# Altium schematic sheet ОУ LM741.SchDoc
size A4; SheetNumber: 1; SheetTotal: 1
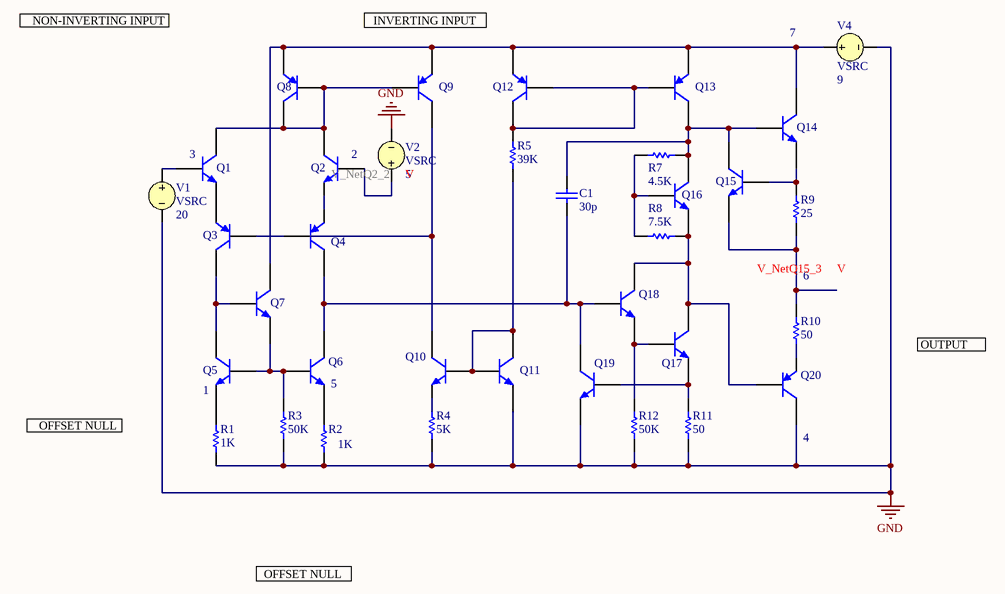
[diagram p0: ОУ LM741.SchDoc]

## Parts
C1  value 30p  (hidden comment: Capacitor)
Q1  Bipolar  NPN 3 Pins  Transistor VBIC Model  (value not drawn)
Q2  Bipolar  NPN 3 Pins  Transistor VBIC Model  (value not drawn)
Q3  Bipolar  PNP 3 Pins  Transistor  Gummel-Poon Model  (value not drawn)
Q4  Bipolar  PNP 3 Pins  Transistor  Gummel-Poon Model  (value not drawn)
Q5  Bipolar  NPN 3 Pins  Transistor VBIC Model  (value not drawn)
Q6  Bipolar  NPN 3 Pins  Transistor VBIC Model  (value not drawn)
Q7  Bipolar  NPN 3 Pins  Transistor VBIC Model  (value not drawn)
Q8  Bipolar  PNP 3 Pins  Transistor  Gummel-Poon Model  (value not drawn)
Q9  Bipolar  PNP 3 Pins  Transistor  Gummel-Poon Model  (value not drawn)
Q10  Bipolar  NPN 3 Pins  Transistor VBIC Model  (value not drawn)
Q11  Bipolar  NPN 3 Pins  Transistor VBIC Model  (value not drawn)
Q12  Bipolar  PNP 3 Pins  Transistor  Gummel-Poon Model  (value not drawn)
Q13  Bipolar  PNP 3 Pins  Transistor  Gummel-Poon Model  (value not drawn)
Q14  Bipolar  NPN 3 Pins  Transistor VBIC Model  (value not drawn)
Q15  Bipolar  NPN 3 Pins  Transistor VBIC Model  (value not drawn)
Q16  Bipolar  NPN 3 Pins  Transistor VBIC Model  (value not drawn)
Q17  Bipolar  NPN 3 Pins  Transistor VBIC Model  (value not drawn)
Q18  Bipolar  NPN 3 Pins  Transistor VBIC Model  (value not drawn)
Q19  Bipolar  NPN 3 Pins  Transistor VBIC Model  (value not drawn)
Q20  Bipolar  PNP 3 Pins   Transistor  VBIC Model  (value not drawn)
R1  value 1K  (hidden comment: Resistor)
R2  value 1K  (hidden comment: Resistor)
R3  value 50K  (hidden comment: Resistor)
R4  value 5K  (hidden comment: Resistor)
R5  value 39K  (hidden comment: Resistor)
R7  value 4.5K  (hidden comment: Resistor)
R8  value 7.5K  (hidden comment: Resistor)
R9  value 25  (hidden comment: Resistor)
R10  value 50  (hidden comment: Resistor)
R11  value 50  (hidden comment: Resistor)
R12  value 50K  (hidden comment: Resistor)
V1  VSRC  value 20
V2  VSRC  DC Magnitude: 5
V4  VSRC  value 9

## Ports
INVERTING INPUT (in), NON-INVERTING INPUT (in), OFFSET NULL, OUTPUT (out)

## Nets
GND: Q11.3(E) Q19.3(E) Q20.1(C) R1.1 R2.1 R3.1 R4.1 R11.1 R12.1 V1.2 V2.2 V4.2
NetC1_1: C1.1 Q4.1(C) Q6.1(C) Q18.2(B) Q19.1(C)
NetC1_2: C1.2 Q13.1(C) Q14.2(B) Q15.1(C) Q16.1(C) R7.1
NetQ1_1: Q1.1(C) Q2.1(C) Q8.1(C) Q8.2(B) Q9.2(B)
NetQ1_2: Q1.2(B) V1.1
NetQ2_2: Q2.2(B) V2.1
NetQ2_3: Q2.3(E) Q4.3(E)
NetQ3_1: Q3.1(C) Q5.1(C) Q7.2(B)
NetQ3_2: Q3.2(B) Q4.2(B)
NetQ5_2: Q5.2(B) Q6.2(B) Q7.3(E) R3.2
NetQ5_3: Q5.3(E) R1.2
NetQ6_3: Q6.3(E) R2.2
NetQ7_1: Q7.1(C) Q8.3(E) Q9.3(E) Q12.3(E) Q13.3(E) Q14.1(C) V4.1
NetQ9_1: Q9.1(C) Q10.1(C)
NetQ10_2: Q10.2(B) Q11.1(C) Q11.2(B) R5.1
NetQ10_3: Q10.3(E) R4.2
NetQ12_1: Q12.1(C) Q12.2(B) Q13.2(B) R5.2
NetQ14_3: Q14.3(E) Q15.2(B) R9.2
NetQ15_3: Q15.3(E) R9.1 R10.2
NetQ16_2: Q16.2(B) R7.2 R8.2
NetQ16_3: Q16.3(E) Q17.1(C) Q18.1(C) Q20.2(B) R8.1
NetQ17_2: Q17.2(B) Q18.3(E) R12.2
NetQ17_3: Q17.3(E) Q19.2(B) R11.2
NetQ20_3: Q20.3(E) R10.1

Not connected (* = marked no-connect by the designer): Q1 3(E); Q3 3(E)

## Notes on the sheet
- (near V4) 7
- (near Q1) 3
- (near Q2) 2
- 6
- (near Q5) 1
- (near Q6) 5
- (near Q20) 4

## Library data of the parts
C1 = Capacitor: SimulationGenericComponent: True
Q1 Q2 Q5-Q7 Q10 Q11 Q14-Q19 = BJT NPN VBIC: SimulationGenericComponent: True; AFN: 1; AJC: -0.5; ART: 0.1; AVC1: 0; EA: 1.12; FC: 0.9; IBBE: 1e-06; IBCI: 1e-16; IBEI: 1e-18; MC: 0.33; NCN: 2; NKF: 0.5; PC: 0.75; TNOM: 27; VERS: 1.2; XII: 3; AJE: -0.5; AJS: -0.5; AVC2: 0; BFN: 1; CBCO: 0; CBEO: 0; CCSO: 0; CJC: 0; CJCP: 0; CJE: 0; CJEP: 0; CTH: 0; DEAR: 0; EAIC: 1.12; EAIE: 1.12; EAIS: 1.12; EANC: 1.12; EANE: 1.12; EANS: 1.12; EAP: 1.12; EBBE: 0; GAMM: 0; HRCF: 1; IBCIP: 0; IBCN: 0; IBCNP: 0; IBEIP: 0; IBEN: 0; IBENP: 0; IKF: 0; IKP: 0; IKR: 0; IS: 1e-16; ISP: 0; ISRR: 1; ITF: 0; KFN: 0; ME: 0.33; MS: 0.33; NBBE: 1; NCI: 1; NCIP: 1; NCNP: 2; NEI: 1; NEN: 2; NF: 1; NFP: 1; NR: 1; PE: 0.75; PS: 0.75; QBM: 0; QCO: 0; QTF: 0; RBI: 0.1; RBP: 0.1; RBX: 0; RCI: 0.1; RCX: 0; RE: 0; RS: 0; RTH: 0; TAVC: 0; TD: 0; TF: 0; TNBBE: 0; TNF: 0; TR: 0; TVBBE1: 0; TVBBE2: 0; VBBE: 0; VEF: 0; VER: 0; VO: 0; VREF: 0; VRT: 0; VTF: 0; WBE: 1; WSP: 1; XIKF: 0; XIN: 3; XIS: 3; XISR: 0; XRBI: 0; XRBP: 0; XRBX: 0; XRCI: 0; XRCX: 0; XRE: 0; XRS: 0; XTF: 0; XVO: 0
Q3 Q4 Q8 Q9 Q12 Q13 = BJT PNP GP: BF: 100; AF: 0; BR: 1; EG: 1.11; FC: 0.5; IS: 1e-16; MJC: 0.33; NC: 2; NE: 1.5; TNOM: 27; VBC_MAX: 1e99; VJC: 0.75; XTI: 3; SimulationGenericComponent: True; CJC: 0; CJE: 0; CJS: 0; CTC: 0; CTE: 0; CTS: 0; IKF: 0; IKR: 0; IRB: 0; ISC: 0; ISE: 0; ISS: 0; ITF: 0; KF: 0; MJE: 0.33; MJS: 0; NF: 1; NKF: 0.5; NR: 1; NS: 1; PTF: 0; RB: 0; RBM: 0; RC: 0; RE: 0; SUBS: 1; TBF1: 0; TBF2: 0; TBR1: 0; TBR2: 0; TF: 0; TIKF1: 0; TIKF2: 0; TIKR1: 0; TIKR2: 0; TIRB1: 0; TIRB2: 0; TIS1: 0; TIS2: 0; TISC1: 0; TISC2: 0; TISE1: 0; TISE2: 0; TITF1: 0; TITF2: 0; TLEV: 0; TLEVC: 0; TMJC1: 0; TMJC2: 0; TMJE1: 0; TMJE2: 0; TMJS1: 0; TMJS2: 0; TNC1: 0; TNC2: 0; TNE1: 0; TNE2: 0; TNF1: 0; TNF2: 0; TNR1: 0; TNR2: 0; TNS1: 0; TNS2: 0; TR: 0; TRB1: 0; TRB2: 0; TRC1: 0; TRC2: 0; TRE1: 0; TRE2: 0; TRM1: 0; TRM2: 0; TTF1: 0; TTF2: 0; TTR1: 0; TTR2: 0; TVAF1: 0; TVAF2: 0; TVAR1: 0; TVAR2: 0; TVJC: 0; TVJE: 0; TVJS: 0; VAF: 0; VAR: 0; VBE_MAX: 1e99; VCE_MAX: 1e99; VJE: 0.75; VJS: 0.75; VTF: 0; XCJC: 1; XTB: 0; XTF: 0
Q20 = BJT PNP VBIC: AFN: 1; AJC: -0.5; ART: 0.1; AVC1: 0; EA: 1.12; FC: 0.9; IBBE: 1e-06; IBCI: 1e-16; IBEI: 1e-18; MC: 0.33; NCN: 2; NKF: 0.5; PC: 0.75; TNOM: 27; VERS: 1.2; XII: 3; SimulationGenericComponent: True; AJE: -0.5; AJS: -0.5; AVC2: 0; BFN: 1; CBCO: 0; CBEO: 0; CCSO: 0; CJC: 0; CJCP: 0; CJE: 0; CJEP: 0; CTH: 0; DEAR: 0; EAIC: 1.12; EAIE: 1.12; EAIS: 1.12; EANC: 1.12; EANE: 1.12; EANS: 1.12; EAP: 1.12; EBBE: 0; GAMM: 0; HRCF: 1; IBCIP: 0; IBCN: 0; IBCNP: 0; IBEIP: 0; IBEN: 0; IBENP: 0; IKF: 0; IKP: 0; IKR: 0; IS: 1e-16; ISP: 0; ISRR: 1; ITF: 0; KFN: 0; ME: 0.33; MS: 0.33; NBBE: 1; NCI: 1; NCIP: 1; NCNP: 2; NEI: 1; NEN: 2; NF: 1; NFP: 1; NR: 1; PE: 0.75; PS: 0.75; QBM: 0; QCO: 0; QTF: 0; RBI: 0.1; RBP: 0.1; RBX: 0; RCI: 0.1; RCX: 0; RE: 0; RS: 0; RTH: 0; TAVC: 0; TD: 0; TF: 0; TNBBE: 0; TNF: 0; TR: 0; TVBBE1: 0; TVBBE2: 0; VBBE: 0; VEF: 0; VER: 0; VO: 0; VREF: 0; VRT: 0; VTF: 0; WBE: 1; WSP: 1; XIKF: 0; XIN: 3; XIS: 3; XISR: 0; XRBI: 0; XRBP: 0; XRBX: 0; XRCI: 0; XRCX: 0; XRE: 0; XRS: 0; XTF: 0; XVO: 0
R1-R5 R7-R12 = Resistor: TC1: 0; SimulationGenericComponent: True; TC2: 0
V1 V4 = VSRC: Voltage Source; Note: PCB Footprint - Not required; AC Magnitude: 1; AC Phase: 0; Published: 30-July-2020; LatestRevisionDate: 30-July-2020; LatestRevisionNote: Re-released for DXP Platform.; PackageReference: Not Applicable; Publisher: Altium Limited
V2 = VSRC: Voltage Source; Note: PCB Footprint - Not required; AC Magnitude: 1; AC Phase: 0; Time Delay: 1n; Rise Time: 0.5; Published: 30-July-2020; LatestRevisionDate: 30-July-2020; LatestRevisionNote: Re-released for DXP Platform.; PackageReference: Not Applicable; Publisher: Altium Limited; Initial Value: 0; Pulsed Value: 5; Fall Time: 0.5; Pulse Width: 1n; Period: 1; Phase: 0